# Altium schematic sheet File2.SchDoc
size A4; SheetNumber: 2; SheetTotal: 4
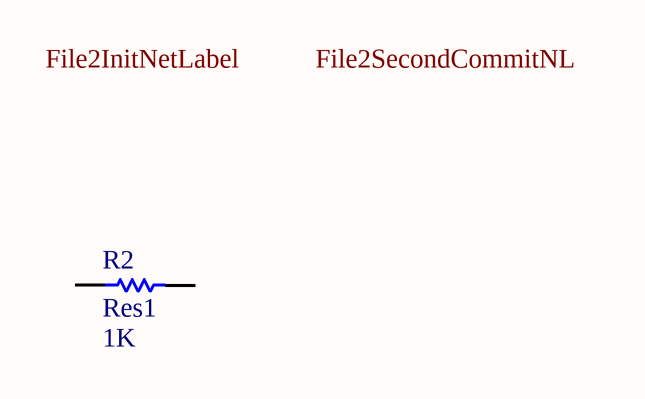
[diagram p0: File2.SchDoc]

## Parts
R2  Res1  value 1K  [AXIAL-0.3]

## Nets

Not connected (* = marked no-connect by the designer): R2 1 2

## Notes on the sheet
- Labels drawn without touching a wire or pin: File2InitNetLabel, File2SecondCommitNL

## Library data of the parts
R2 = Res1: Resistor; Published: 8-Jun-2000; LatestRevisionDate: 17-Jul-2002; LatestRevisionNote: Re-released for DXP Platform.; PackageReference: AXIAL-0.3; Publisher: Altium Limited; PackageDescription: Axial Device, Thru-Hole; 2 Leads; 0.3 in Pin Spacing